# Altium project PLC_Cong.PrjPcb
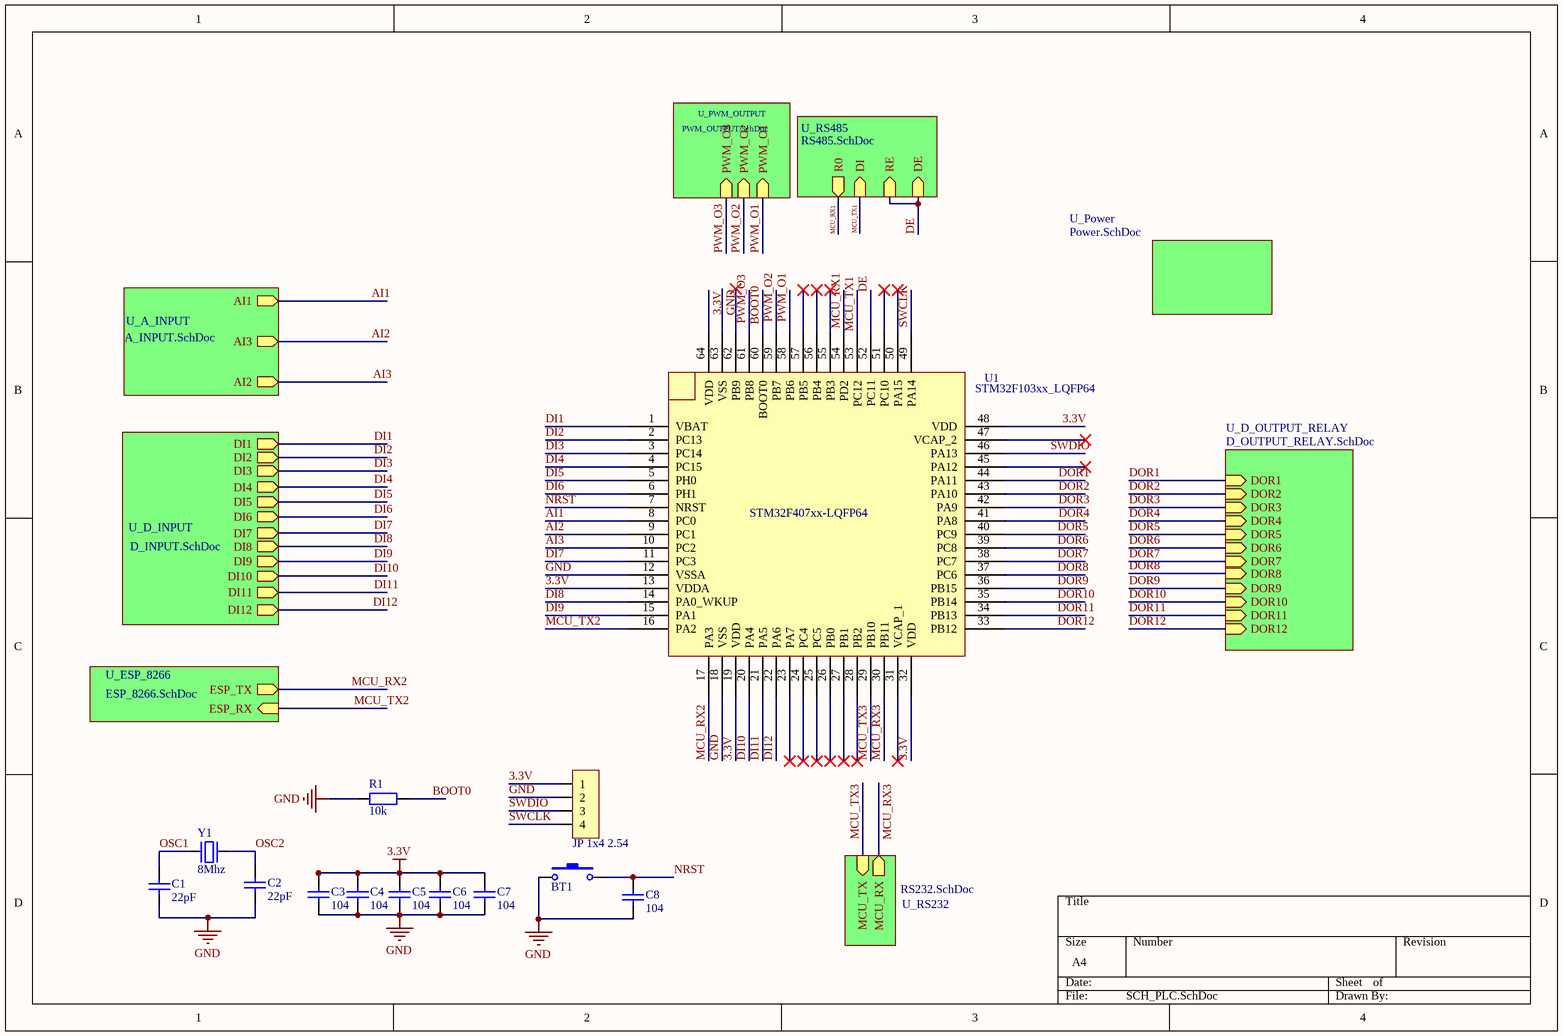
[diagram p0: SCH_PLC.SchDoc]
9 sheets, 169 parts. Net scope: hierarchical (ports join the sheet entries above them; power ports are global).
Board file: PCB_PLC.PcbDoc
Sheets:
  SCH_PLC.SchDoc
    U_A_INPUT = A_INPUT.SchDoc
    U_D_INPUT = D_INPUT.SchDoc
    U_RS232 = RS232.SchDoc
    U_RS485 = RS485.SchDoc
    U_PWM_OUTPUT = PWM_OUTPUT.SchDoc
    U_ESP_8266 = ESP_8266.SchDoc
    U_D_OUTPUT_RELAY = D_OUTPUT_RELAY.SchDoc
    U_Power = Power.SchDoc

## Sheet SCH_PLC.SchDoc
size A4; SheetNumber: 1; SheetTotal: 9

### Parts
BT1  Nut Nhan 2 Chan SMD 3x6x2.5  [Nut Nhan 2 Chan SMD 3x6x2.5]  (value not drawn)
C1  22pF  [tu 0805]
C2  22pF  [tu 0805]
C3  104  [tu 0805]
C4  104  [tu 0805]
C5  104  [tu 0805]
C6  104  [tu 0805]
C7  104  [tu 0805]
C8  104  [tu 0805]
JP1  JP 1x4 2.54  [JP 1x4 DT]
R1  10k  [tro smd 0805]
U1  STM32F103xx_LQFP64  [STM32_LQFP64]
Y1  8Mhz  [Thach Anh 2 chan SMD]

### Sub-sheets
U_A_INPUT = A_INPUT.SchDoc: AI1 (out), AI3 (out), AI2 (out)
U_D_INPUT = D_INPUT.SchDoc: DI7 (out), DI2 (out), DI12 (out), DI3 (out), DI10 (out), DI8 (out), DI11 (out), DI9 (out), DI6 (out), DI1 (out), DI5 (out), DI4 (out)
U_D_OUTPUT_RELAY = D_OUTPUT_RELAY.SchDoc: DOR6 (in), DOR8 (in), DOR12 (in), DOR11 (in), DOR5 (in), DOR4 (in), DOR3 (in), DOR1 (in), DOR7 (in), DOR2 (in), DOR9 (in), DOR10 (in)
U_ESP_8266 = ESP_8266.SchDoc: ESP_TX (out), ESP_RX (in)
U_Power = Power.SchDoc: no entries
U_PWM_OUTPUT = PWM_OUTPUT.SchDoc: PWM_O3 (in), PWM_O1 (in), PWM_O2 (in)
U_RS232 = RS232.SchDoc: MCU_RX (out), MCU_TX (in)
U_RS485 = RS485.SchDoc: RE (in), DE (in), DI (in), R0 (out)

### Nets
3.3V: C3.1 C4.1 C5.1 C6.2 C7.2 JP1.1 U1.13(VDDA) U1.19(VDD) U1.32(VDD) U1.48(VDD) U1.64(VDD)
GND: BT1.1 C1.2 C2.2 C3.2 C4.2 C5.2 C6.1 C7.1 C8.1 JP1.2 R1.1 U1.12(VSSA) U1.18(VSS) U1.63(VSS)
AI1: U1.8(PC0) ; sheet U_A_INPUT/AI1
AI2: U1.9(PC1) ; sheet U_A_INPUT/AI3
AI3: U1.10(PC2) ; sheet U_A_INPUT/AI2
BOOT0: R1.2 U1.60(BOOT0)
DE: U1.52(PC11) ; sheet U_RS485/RE, sheet U_RS485/DE
DI1: U1.1(VBAT) ; sheet U_D_INPUT/DI1
DI2: U1.2(PC13) ; sheet U_D_INPUT/DI2
DI3: U1.3(PC14) ; sheet U_D_INPUT/DI3
DI4: U1.4(PC15) ; sheet U_D_INPUT/DI4
DI5: U1.5(PH0) ; sheet U_D_INPUT/DI5
DI6: U1.6(PH1) ; sheet U_D_INPUT/DI6
DI7: U1.11(PC3) ; sheet U_D_INPUT/DI7
DI8: U1.14(PA0_WKUP) ; sheet U_D_INPUT/DI8
DI9: U1.15(PA1) ; sheet U_D_INPUT/DI9
DI10: U1.20(PA4) ; sheet U_D_INPUT/DI10
DI11: U1.21(PA5) ; sheet U_D_INPUT/DI11
DI12: U1.22(PA6) ; sheet U_D_INPUT/DI12
DOR1: U1.44(PA11) ; sheet U_D_OUTPUT_RELAY/DOR1
DOR2: U1.43(PA10) ; sheet U_D_OUTPUT_RELAY/DOR2
DOR3: U1.42(PA9) ; sheet U_D_OUTPUT_RELAY/DOR3
DOR4: U1.41(PA8) ; sheet U_D_OUTPUT_RELAY/DOR4
DOR5: U1.40(PC9) ; sheet U_D_OUTPUT_RELAY/DOR5
DOR6: U1.39(PC8) ; sheet U_D_OUTPUT_RELAY/DOR6
DOR7: U1.38(PC7) ; sheet U_D_OUTPUT_RELAY/DOR7
DOR8: U1.37(PC6) ; sheet U_D_OUTPUT_RELAY/DOR8
DOR9: U1.36(PB15) ; sheet U_D_OUTPUT_RELAY/DOR9
DOR10: U1.35(PB14) ; sheet U_D_OUTPUT_RELAY/DOR10
DOR11: U1.34(PB13) ; sheet U_D_OUTPUT_RELAY/DOR11
DOR12: U1.33(PB12) ; sheet U_D_OUTPUT_RELAY/DOR12
MCU_RX1: U1.54(PD2) ; sheet U_RS485/R0
MCU_RX2: U1.17(PA3) ; sheet U_ESP_8266/ESP_TX
MCU_RX3: U1.30(PB11) ; sheet U_RS232/MCU_RX
MCU_TX1: U1.53(PC12) ; sheet U_RS485/DI
MCU_TX2: U1.16(PA2) ; sheet U_ESP_8266/ESP_RX
MCU_TX3: U1.29(PB10) ; sheet U_RS232/MCU_TX
NRST: BT1.2 C8.2 U1.7(NRST)
OSC1: C1.1 Y1.1
OSC2: C2.1 Y1.2
PWM_O1: U1.58(PB6) ; sheet U_PWM_OUTPUT/PWM_O1
PWM_O2: U1.59(PB7) ; sheet U_PWM_OUTPUT/PWM_O2
PWM_O3: U1.61(PB8) ; sheet U_PWM_OUTPUT/PWM_O3
SWCLK: JP1.4 U1.49(PA14)
SWDIO: JP1.3 U1.46(PA13)

Not connected (* = marked no-connect by the designer): U1 23(PA7)* 24(PC4)* 25(PC5)* 26(PB0)* 27(PB1)* 28(PB2)* 31(VCAP_1)* 45(PA12)* 47(VCAP_2)* 50(PA15)* 51(PC10)* 55(PB3)* 56(PB4)* 57(PB5)* 62(PB9)*

### Notes on the sheet
- (in symbol STM32F103xx_LQFP64) STM32F407xx-LQFP64

### Library data of the parts
BT1 = Nut Nhan 2 Chan SMD 3x6x2.5: Ma_Hang: MH001036; Ten: Nút Nhấn 2 Chân 3x6x2.5MM SMD
C1 C2 = Tu 0805 22pF 50V 10%: Dán; Don_Vi: Con; So_Chan: 2; Ten_Linh_Kien: Tụ 0805 22P 10% 50V; Ma_Hang: MH004560; Chung_Loai: Dán; Kieu_Chan: *
C3-C8 = Tu 0805 104 50V 10%: Dán; Don_Vi: Con; So_Chan: 2; Ten_Linh_Kien: Tụ 0805 104-100nF 10% 50V; Ma_Hang: MH004551; Chung_Loai: Dán; Kieu_Chan: *
JP1 = JP 1x4 2.54 Duc Thang: Cắm; Ten_Linh_Kien: Jump Đơn Đực 2.54MM 1x40P Thẳng 11MM; Don_Vi: Con; Ma_Hang: MH000903; Ghi_Chu: *; Kieu_Chan: *; Chung_Loai: Cắm
R1 = Tro 0805 1% 10k: Dán; Don_Vi: Con; So_Chan: 2; Ten_Linh_Kien: Trở 0805 1% 10k; Ma_Hang: MH005473; Chung_Loai: Dán; Kieu_Chan: *
Y1 = Thach Anh 2 chan SMD: Crystal For all Crystal 2pin.; Value: 4Mhz

## Sheet A_INPUT.SchDoc
size A4; SheetNumber: 9; SheetTotal: 9
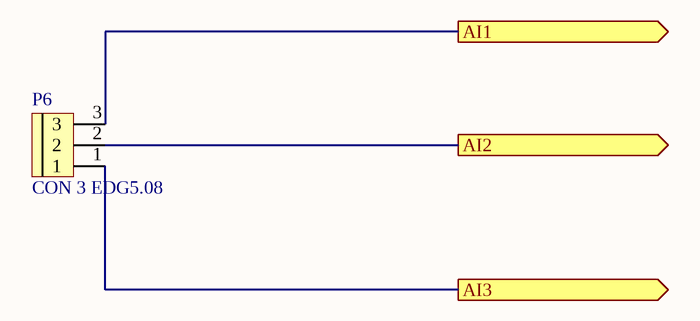
[diagram p1: A_INPUT.SchDoc]

### Parts
P6  CON 3 EDG5.08  [CON 3 3EDG5.08]

### Ports
AI1 (out), AI2 (out), AI3 (out)

### Nets
AI1: P6.3 ; port AI1
AI2: P6.1 ; port AI3
AI3: P6.2 ; port AI2

### Library data of the parts
P6 = CON 3 EDG5.08: Cắm; Ten_Linh_Kien: CON 3 2EDG5.08-3P 5.08MM ( Xanh Cong); Ma_Hang: MH000760; Ghi_Chu: *; Kieu_Chan: *; Don_Vi: Con; Chung_Loai: Cắm

## Sheet D_INPUT.SchDoc
size A4; SheetNumber: 8; SheetTotal: 9
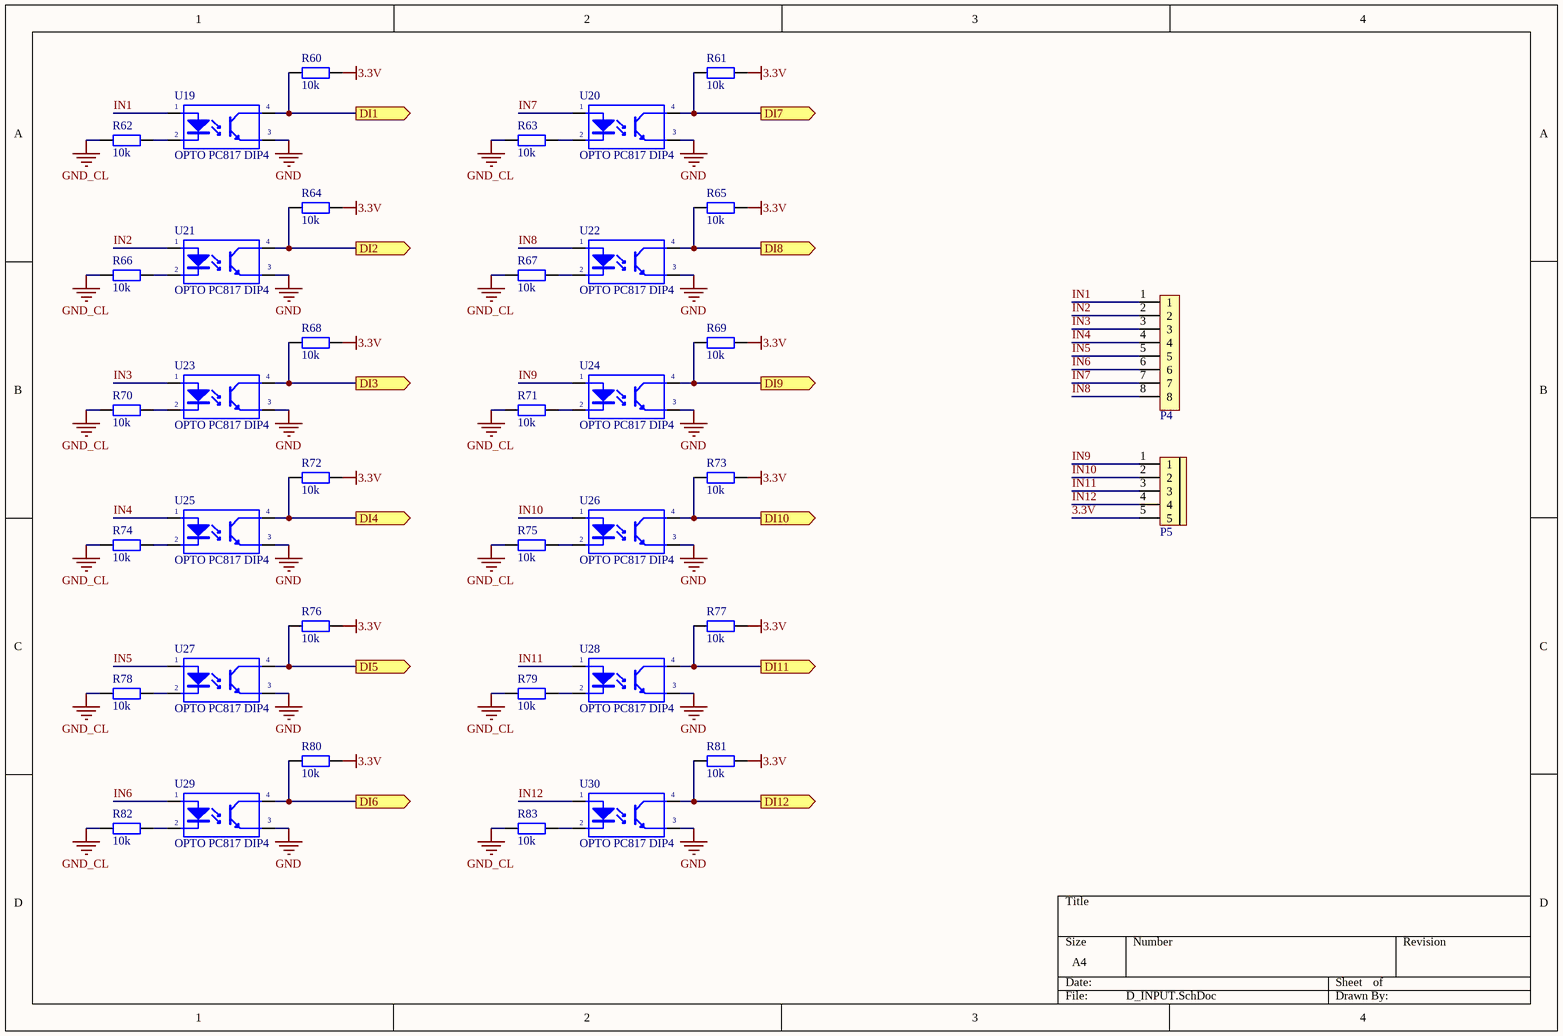
[diagram p2: D_INPUT.SchDoc]

### Parts
P4  CON 8 EDG5.08  [CON 8 8EDG5.08]  (value not drawn)
P5  CON 5 EDG5.08  [CON 5 5EDG5.08]  (value not drawn)
R60  10k  [tro smd 0805]
R61  10k  [tro smd 0805]
R62  10k  [tro smd 0805]
R63  10k  [tro smd 0805]
R64  10k  [tro smd 0805]
R65  10k  [tro smd 0805]
R66  10k  [tro smd 0805]
R67  10k  [tro smd 0805]
R68  10k  [tro smd 0805]
R69  10k  [tro smd 0805]
R70  10k  [tro smd 0805]
R71  10k  [tro smd 0805]
R72  10k  [tro smd 0805]
R73  10k  [tro smd 0805]
R74  10k  [tro smd 0805]
R75  10k  [tro smd 0805]
R76  10k  [tro smd 0805]
R77  10k  [tro smd 0805]
R78  10k  [tro smd 0805]
R79  10k  [tro smd 0805]
R80  10k  [tro smd 0805]
R81  10k  [tro smd 0805]
R82  10k  [tro smd 0805]
R83  10k  [tro smd 0805]
U19  OPTO PC817 DIP4  [DIP4]
U20  OPTO PC817 DIP4  [DIP4]
U21  OPTO PC817 DIP4  [DIP4]
U22  OPTO PC817 DIP4  [DIP4]
U23  OPTO PC817 DIP4  [DIP4]
U24  OPTO PC817 DIP4  [DIP4]
U25  OPTO PC817 DIP4  [DIP4]
U26  OPTO PC817 DIP4  [DIP4]
U27  OPTO PC817 DIP4  [DIP4]
U28  OPTO PC817 DIP4  [DIP4]
U29  OPTO PC817 DIP4  [DIP4]
U30  OPTO PC817 DIP4  [DIP4]

### Ports
DI1 (out), DI2 (out), DI3 (out), DI4 (out), DI5 (out), DI6 (out), DI7 (out), DI8 (out), DI9 (out), DI10 (out), DI11 (out), DI12 (out)

### Nets
3.3V: P5.5 R60.1 R61.1 R64.1 R65.1 R68.1 R69.1 R72.1 R73.1 R76.1 R77.1 R80.1 R81.1
GND: U19.3(E) U20.3(E) U21.3(E) U22.3(E) U23.3(E) U24.3(E) U25.3(E) U26.3(E) U27.3(E) U28.3(E) U29.3(E) U30.3(E)
GND_CL: R62.1 R63.1 R66.1 R67.1 R70.1 R71.1 R74.1 R75.1 R78.1 R79.1 R82.1 R83.1
DI1: R60.2 U19.4(C) ; port DI1
DI2: R64.2 U21.4(C) ; port DI2
DI3: R68.2 U23.4(C) ; port DI3
DI4: R72.2 U25.4(C) ; port DI4
DI5: R76.2 U27.4(C) ; port DI5
DI6: R80.2 U29.4(C) ; port DI6
DI7: R61.2 U20.4(C) ; port DI7
DI8: R65.2 U22.4(C) ; port DI8
DI9: R69.2 U24.4(C) ; port DI9
DI10: R73.2 U26.4(C) ; port DI10
DI11: R77.2 U28.4(C) ; port DI11
DI12: R81.2 U30.4(C) ; port DI12
IN1: P4.1 U19.1(A)
IN2: P4.2 U21.1(A)
IN3: P4.3 U23.1(A)
IN4: P4.4 U25.1(A)
IN5: P4.5 U27.1(A)
IN6: P4.6 U29.1(A)
IN7: P4.7 U20.1(A)
IN8: P4.8 U22.1(A)
IN9: P5.1 U24.1(A)
IN10: P5.2 U26.1(A)
IN11: P5.3 U28.1(A)
IN12: P5.4 U30.1(A)
NetR62_2: R62.2 U19.2(K)
NetR63_2: R63.2 U20.2(K)
NetR66_2: R66.2 U21.2(K)
NetR67_2: R67.2 U22.2(K)
NetR70_2: R70.2 U23.2(K)
NetR71_2: R71.2 U24.2(K)
NetR74_2: R74.2 U25.2(K)
NetR75_2: R75.2 U26.2(K)
NetR78_2: R78.2 U27.2(K)
NetR79_2: R79.2 U28.2(K)
NetR82_2: R82.2 U29.2(K)
NetR83_2: R83.2 U30.2(K)

### Library data of the parts
P4 = CON 8 EDG5.08: Cắm; Ten_Linh_Kien: CON 8 2EDG5.08-8P 5.08MM ( Xanh Cong); Ma_Hang: MH000978; Don_Vi: Con; Ghi_Chu: *; Kieu_Chan: *; Chung_Loai: Cắm
P5 = CON 5 EDG5.08: Cắm; Ten_Linh_Kien: CON 5 2EDG5.08-5P 5.08MM ( Xanh Cong); Ma_Hang: MH003589; Kieu_Chan: *; Don_Vi: Con; Ghi_Chu: *; Chung_Loai: Cắm
R60-R83 = Tro 0805 1% 10k: as R1 on sheet SCH_PLC; Chung_Loai: Dán; Kieu_Chan: *
U19-U30 = OPTO PC817 DIP4: Single Opto; Value: PC817

## Sheet RS232.SchDoc
size A4; SheetNumber: 3; SheetTotal: 9
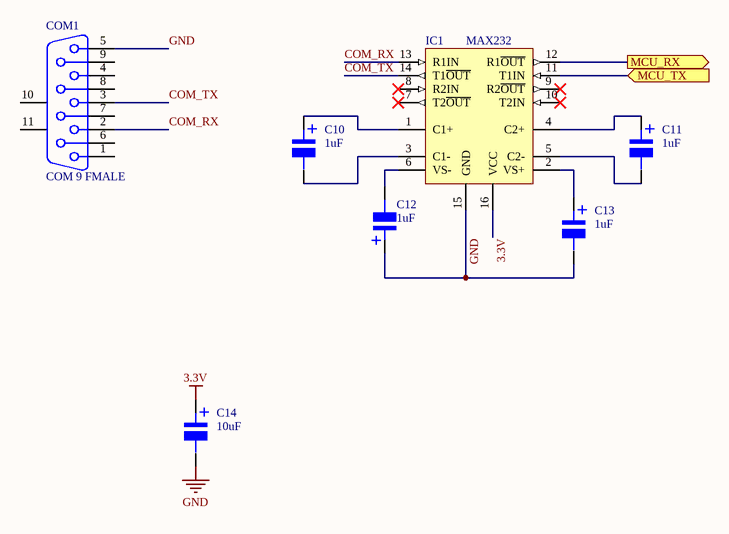
[diagram p3: RS232.SchDoc]

### Parts
C10  1uF  [tu nhom 4 (B)]
C11  1uF  [tu nhom 4 (B)]
C12  1uF  [tu nhom 4 (B)]
C13  1uF  [tu nhom 4 (B)]
C14  10uF  [tu nhom 4 (b)]
COM1  COM 9 FMALE  [DSB 9-F]
IC1  MAX232  [DIP16/W0.3]

### Ports
MCU_RX (out), MCU_TX (in)

### Nets
3.3V: C14.1 IC1.16(VCC)
GND: C12.1 C13.2 C14.2 COM1.5 IC1.15(GND)
COM_RX: COM1.2 IC1.13(R1IN)
COM_TX: COM1.3 IC1.14(T1~{OUT})
MCU_RX3: IC1.12(R1~{OUT}) ; port MCU_RX
MCU_TX3: IC1.11(T1IN) ; port MCU_TX
NetC10_1: C10.1 IC1.1(C1+)
NetC10_2: C10.2 IC1.3(C1-)
NetC11_1: C11.1 IC1.4(C2+)
NetC11_2: C11.2 IC1.5(C2-)
NetC12_2: C12.2 IC1.6(VS-)
NetC13_1: C13.1 IC1.2(VS+)

Not connected (* = marked no-connect by the designer): COM1 1 4 6 7 8 9 10(MH1) 11(MH2); IC1 7(T2~{OUT})* 8(R2IN)* 9(R2~{OUT})* 10(T2IN)*

### Notes on the sheet
- (in symbol Tu Nhom 1uF 50V) +
- (in symbol Tu Nhom 10uF 16V) +

### Library data of the parts
C10-C13 = Tu Nhom 1uF 50V: Dán; Don_Vi: Con; So_Chan: 2; Ten_Linh_Kien: Tụ Nhôm 1uF 50V 4x5.4MM; Ma_Hang: MH007467; Chung_Loai: Dán; Kieu_Chan: *
C14 = Tu Nhom 10uF 16V: Dán; Don_Vi: Con; So_Chan: 2; Ten_Linh_Kien: Tụ Nhôm 10uF 16V 4x5MM; Ma_Hang: MH001458; Chung_Loai: Dán; Kieu_Chan: *
COM1 = DSB9F: COM 9; PackageDocument: O; Positions: 9; Gender: Receptacle; Value: COM 9; Published: 15-Jun-2001; LatestRevisionDate: 17-Jul-2002; LatestRevisionNote: Re-released for DXP Platform.; DatasheetDocument: 1-Sep-1999; PackageReference: 788750; Publisher: Altium Limited; Orientation: Right Angle
IC1 = MAX232: Dual EIA-232 Driver/Receiver; Value: MAX232

## Sheet RS485.SchDoc
size A4; SheetNumber: 5; SheetTotal: 9
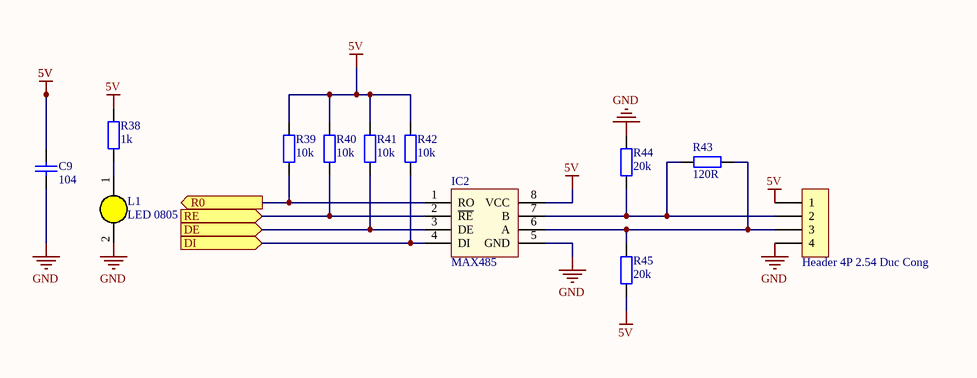
[diagram p4: RS485.SchDoc]

### Parts
C9  104  [tu 0805]
H1  Header 4P 2.54 Duc Cong  [Header 4P DC 2.54]
IC2  MAX485  [DIP8/W0.3]
L1  LED 0805  [LED-0805-Yellow]
R38  1k  [tro smd 0805]
R39  10k  [tro smd 0805]
R40  10k  [tro smd 0805]
R41  10k  [tro smd 0805]
R42  10k  [tro smd 0805]
R43  120R  [tro smd 0805]
R44  20k  [tro smd 0805]
R45  20k  [tro smd 0805]

### Ports
DE (in), DI (in), R0 (out), RE (in)

### Nets
5V: C9.2 H1.1 IC2.8(VCC) R38.2 R39.2 R40.2 R41.2 R42.2 R45.2
GND: C9.1 H1.4 IC2.5(GND) L1.2(K) R44.2
DE: IC2.2(~{RE}) IC2.3(DE) R40.1 R41.1 ; port RE, port DE
MCU_RX1: IC2.1(RO) R39.1 ; port R0
MCU_TX1: IC2.4(DI) R42.1 ; port DI
NetH1_2: H1.2 IC2.7(B) R43.1 R44.1
NetH1_3: H1.3 IC2.6(A) R43.2 R45.1
NetL1_1: L1.1(A) R38.1

### Library data of the parts
C9 = Tu 0805 104 50V 10%: as C3 on sheet SCH_PLC; Chung_Loai: Dán; Kieu_Chan: *
H1 = Header 4P 2.54 Duc Cong: Cắm; Ten_Linh_Kien: Header 4P XH2.54-4P Đực Cong; Don_Vi: Con; Ma_Hang: MH001310; Chung_Loai: Cắm
IC2 = MAX485: RS232 - RS485 (Same sn75176)
L1 = LED 0805 Vang: Dán; Don_Vi: Con; Ma_Hang: MH002329; Ten_Linh_Kien: LED 0805 Màu Vàng ( Yellow); Ghi_Chu: *; Kieu_Chan: *; Chung_Loai: Dán
R38 = Tro 0805 1% 1k: Dán; Don_Vi: Con; So_Chan: 2; Ten_Linh_Kien: Trở 0805 1% 1k; Ma_Hang: MH005468; Chung_Loai: Dán; Kieu_Chan: *
R39-R42 = Tro 0805 1% 10k: as R1 on sheet SCH_PLC; Chung_Loai: Dán; Kieu_Chan: *
R43 = Tro 0805 5% 120R: Dán; Don_Vi: Con; So_Chan: 2; Ten_Linh_Kien: Trở 0805 5% 120R; Ma_Hang: MH005253; Chung_Loai: Dán; Kieu_Chan: *
R44 R45 = Tro 0805 5% 20k: Dán; Don_Vi: Con; So_Chan: 2; Ten_Linh_Kien: Trở 0805 5% 20k; Ma_Hang: MH005247; Chung_Loai: Dán; Kieu_Chan: *

## Sheet PWM_OUTPUT.SchDoc
size A4; SheetNumber: 7; SheetTotal: 9
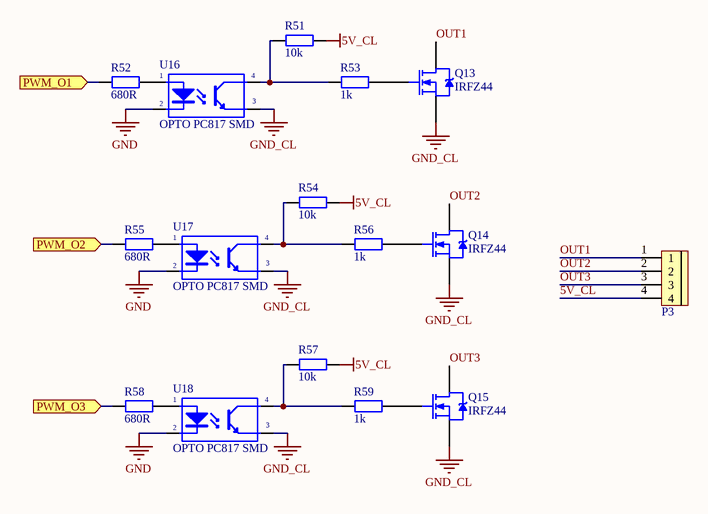
[diagram p5: PWM_OUTPUT.SchDoc]

### Parts
P3  CON 4 EDG5.08  [CON 4 4EDG5.08]  (value not drawn)
Q13  IRFZ44  [TO220]
Q14  IRFZ44  [TO220]
Q15  IRFZ44  [TO220]
R51  10k  [tro smd 0805]
R52  680R  [tro smd 0805]
R53  1k  [tro smd 0805]
R54  10k  [tro smd 0805]
R55  680R  [tro smd 0805]
R56  1k  [tro smd 0805]
R57  10k  [tro smd 0805]
R58  680R  [tro smd 0805]
R59  1k  [tro smd 0805]
U16  OPTO PC817 SMD  [SOP4]
U17  OPTO PC817 SMD  [SOP4]
U18  OPTO PC817 SMD  [SOP4]

### Ports
PWM_O1 (in), PWM_O2 (in), PWM_O3 (in)

### Nets
5V_CL: P3.4 R51.1 R54.1 R57.1
GND: U16.2(K) U17.2(K) U18.2(K)
GND_CL: Q13.3(S) Q14.3(S) Q15.3(S) U16.3(E) U17.3(E) U18.3(E)
OUT1: P3.1 Q13.2(D)
OUT2: P3.2 Q14.2(D)
OUT3: P3.3 Q15.2(D)
PWM_O1: R52.1 ; port PWM_O1
PWM_O2: R55.1 ; port PWM_O2
PWM_O3: R58.1 ; port PWM_O3
NetQ13_1: Q13.1(G) R53.2
NetQ14_1: Q14.1(G) R56.2
NetQ15_1: Q15.1(G) R59.2
NetR51_2: R51.2 R53.1 U16.4(C)
NetR52_2: R52.2 U16.1(A)
NetR54_2: R54.2 R56.1 U17.4(C)
NetR55_2: R55.2 U17.1(A)
NetR57_2: R57.2 R59.1 U18.4(C)
NetR58_2: R58.2 U18.1(A)

### Library data of the parts
P3 = CON 4 EDG5.08: Cắm; Ten_Linh_Kien: CON 4 2EDG5.08-4P 5.08MM ( Xanh Cong); Ma_Hang: MH000979; Don_Vi: Con; Ghi_Chu: *; Kieu_Chan: *; Chung_Loai: Cắm
Q13-Q15 = IRFZ44 DIP: N-Channel Power MOSFET
R51 R54 R57 = Tro 0805 1% 10k: as R1 on sheet SCH_PLC; Chung_Loai: Dán; Kieu_Chan: *
R52 R55 R58 = Tro 0805 1% 680R: Dán; Don_Vi: Con; So_Chan: 2; Ten_Linh_Kien: Trở 0805 1% 680R; Ma_Hang: MH005487; Chung_Loai: Dán; Kieu_Chan: *
R53 R56 R59 = Tro 0805 1% 1k: as R38 on sheet RS485; Chung_Loai: Dán; Kieu_Chan: *
U16-U18 = OPTO PC817 SMD: Single Opto; Value: PC817

## Sheet ESP_8266.SchDoc
size A4; SheetNumber: 6; SheetTotal: 9
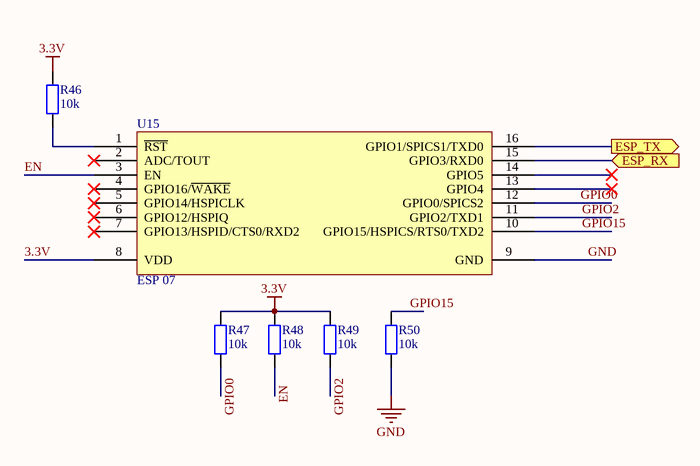
[diagram p6: ESP_8266.SchDoc]

### Parts
R46  10k  [tro smd 0805]
R47  10k  [tro smd 0805]
R48  10k  [tro smd 0805]
R49  10k  [tro smd 0805]
R50  10k  [tro smd 0805]
U15  ESP 07  [ESP8266 07]

### Ports
ESP_RX (in), ESP_TX (out)

### Nets
3.3V: R46.2 R47.2 R48.2 R49.2 U15.8(VDD)
GND: R50.1 U15.9(GND)
EN: R48.1 U15.3(EN)
GPIO0: R47.1 U15.12(GPIO0/SPICS2)
GPIO2: R49.1 U15.11(GPIO2/TXD1)
GPIO15: R50.2 U15.10(GPIO15/HSPICS/RTS0/TXD2)
MCU_RX2: U15.16(GPIO1/SPICS1/TXD0) ; port ESP_TX
MCU_TX2: U15.15(GPIO3/RXD0) ; port ESP_RX
NetR46_1: R46.1 U15.1(~{RST})

Not connected (* = marked no-connect by the designer): U15 2(ADC/TOUT)* 4(GPIO16/~{WAKE})* 5(GPIO14/HSPICLK)* 6(GPIO12/HSPIQ)* 7(GPIO13/HSPID/CTS0/RXD2)* 13(GPIO4)* 14(GPIO5)*

### Library data of the parts
R46-R50 = Tro 0805 1% 10k: as R1 on sheet SCH_PLC; Chung_Loai: Dán; Kieu_Chan: *
U15 = ESP8266 07: ESP8266 07 16 Pin; IC: ESP8266-EX; Vendor: Ai-thinker

## Sheet D_OUTPUT_RELAY.SchDoc
size A4; SheetNumber: 2; SheetTotal: 9
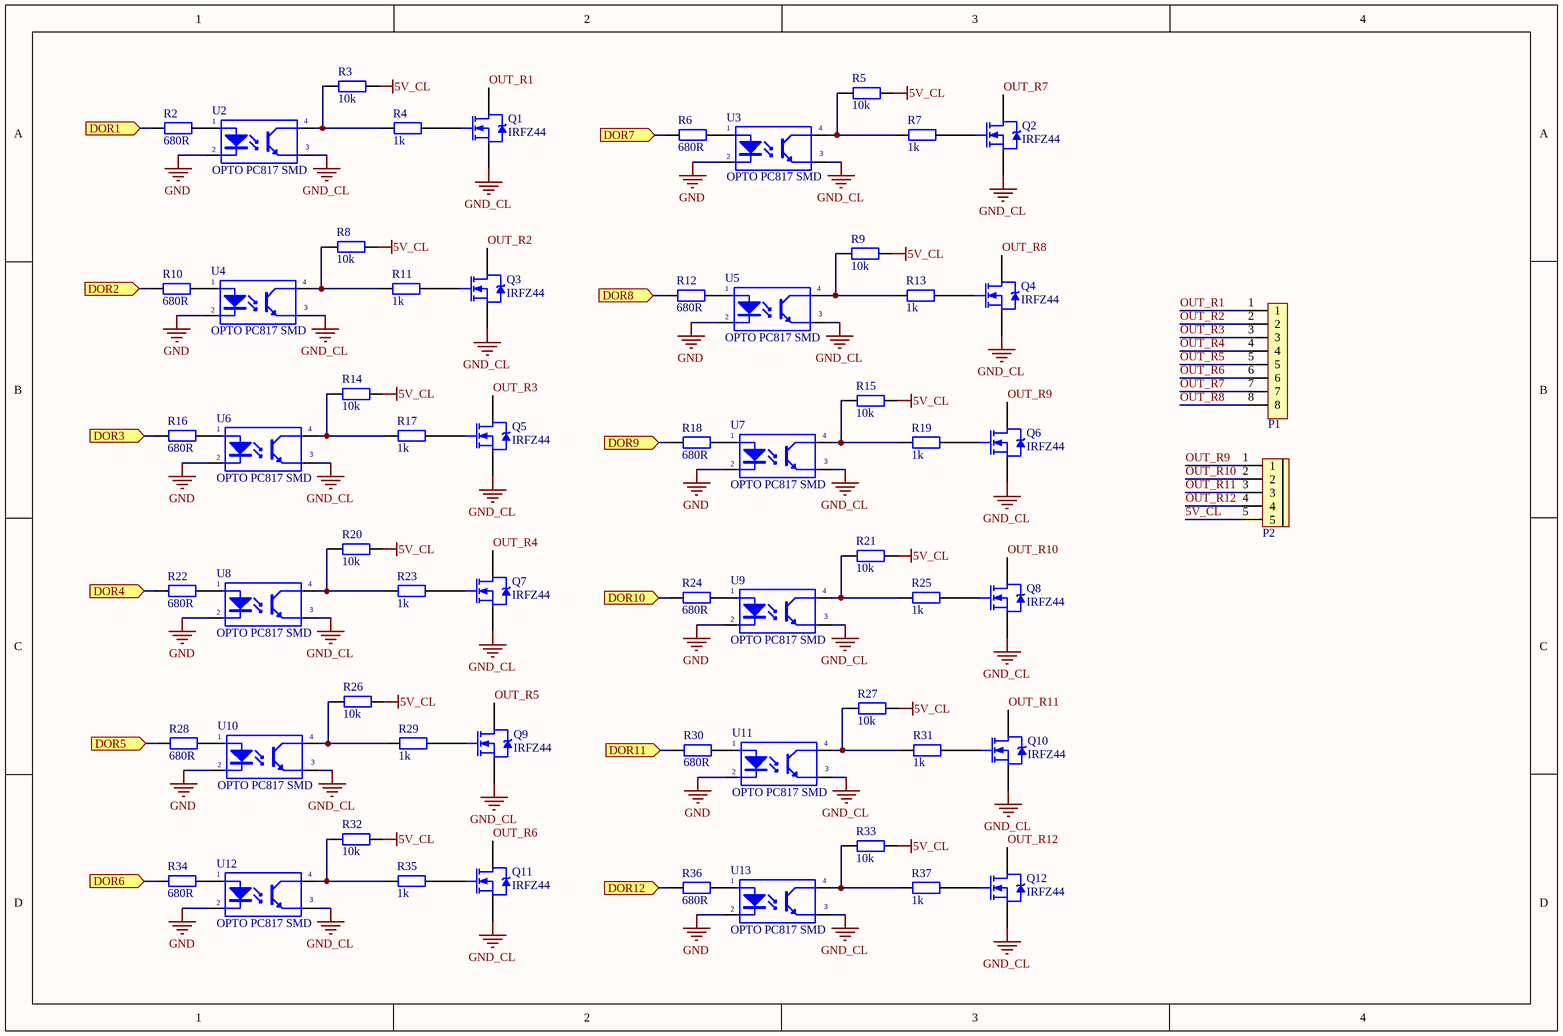
[diagram p7: D_OUTPUT_RELAY.SchDoc]

### Parts
P1  CON 8 EDG5.08  [CON 8 8EDG5.08]  (value not drawn)
P2  CON 5 EDG5.08  [CON 5 5EDG5.08]  (value not drawn)
Q1  IRFZ44  [TO220]
Q2  IRFZ44  [TO220]
Q3  IRFZ44  [TO220]
Q4  IRFZ44  [TO220]
Q5  IRFZ44  [TO220]
Q6  IRFZ44  [TO220]
Q7  IRFZ44  [TO220]
Q8  IRFZ44  [TO220]
Q9  IRFZ44  [TO220]
Q10  IRFZ44  [TO220]
Q11  IRFZ44  [TO220]
Q12  IRFZ44  [TO220]
R2  680R  [tro smd 0805]
R3  10k  [tro smd 0805]
R4  1k  [tro smd 0805]
R5  10k  [tro smd 0805]
R6  680R  [tro smd 0805]
R7  1k  [tro smd 0805]
R8  10k  [tro smd 0805]
R9  10k  [tro smd 0805]
R10  680R  [tro smd 0805]
R11  1k  [tro smd 0805]
R12  680R  [tro smd 0805]
R13  1k  [tro smd 0805]
R14  10k  [tro smd 0805]
R15  10k  [tro smd 0805]
R16  680R  [tro smd 0805]
R17  1k  [tro smd 0805]
R18  680R  [tro smd 0805]
R19  1k  [tro smd 0805]
R20  10k  [tro smd 0805]
R21  10k  [tro smd 0805]
R22  680R  [tro smd 0805]
R23  1k  [tro smd 0805]
R24  680R  [tro smd 0805]
R25  1k  [tro smd 0805]
R26  10k  [tro smd 0805]
R27  10k  [tro smd 0805]
R28  680R  [tro smd 0805]
R29  1k  [tro smd 0805]
R30  680R  [tro smd 0805]
R31  1k  [tro smd 0805]
R32  10k  [tro smd 0805]
R33  10k  [tro smd 0805]
R34  680R  [tro smd 0805]
R35  1k  [tro smd 0805]
R36  680R  [tro smd 0805]
R37  1k  [tro smd 0805]
U2  OPTO PC817 SMD  [SOP4]
U3  OPTO PC817 SMD  [SOP4]
U4  OPTO PC817 SMD  [SOP4]
U5  OPTO PC817 SMD  [SOP4]
U6  OPTO PC817 SMD  [SOP4]
U7  OPTO PC817 SMD  [SOP4]
U8  OPTO PC817 SMD  [SOP4]
U9  OPTO PC817 SMD  [SOP4]
U10  OPTO PC817 SMD  [SOP4]
U11  OPTO PC817 SMD  [SOP4]
U12  OPTO PC817 SMD  [SOP4]
U13  OPTO PC817 SMD  [SOP4]

### Ports
DOR1 (in), DOR2 (in), DOR3 (in), DOR4 (in), DOR5 (in), DOR6 (in), DOR7 (in), DOR8 (in), DOR9 (in), DOR10 (in), DOR11 (in), DOR12 (in)

### Nets
5V_CL: P2.5 R3.1 R5.1 R8.1 R9.1 R14.1 R15.1 R20.1 R21.1 R26.1 R27.1 R32.1 R33.1
GND: U2.2(K) U3.2(K) U4.2(K) U5.2(K) U6.2(K) U7.2(K) U8.2(K) U9.2(K) U10.2(K) U11.2(K) U12.2(K) U13.2(K)
GND_CL: Q1.3(S) Q2.3(S) Q3.3(S) Q4.3(S) Q5.3(S) Q6.3(S) Q7.3(S) Q8.3(S) Q9.3(S) Q10.3(S) Q11.3(S) Q12.3(S) U2.3(E) U3.3(E) U4.3(E) U5.3(E) U6.3(E) U7.3(E) U8.3(E) U9.3(E) U10.3(E) U11.3(E) U12.3(E) U13.3(E)
DOR1: R2.1 ; port DOR1
DOR2: R10.1 ; port DOR2
DOR3: R16.1 ; port DOR3
DOR4: R22.1 ; port DOR4
DOR5: R28.1 ; port DOR5
DOR6: R34.1 ; port DOR6
DOR7: R6.1 ; port DOR7
DOR8: R12.1 ; port DOR8
DOR9: R18.1 ; port DOR9
DOR10: R24.1 ; port DOR10
DOR11: R30.1 ; port DOR11
DOR12: R36.1 ; port DOR12
OUT_R1: P1.1 Q1.2(D)
OUT_R2: P1.2 Q3.2(D)
OUT_R3: P1.3 Q5.2(D)
OUT_R4: P1.4 Q7.2(D)
OUT_R5: P1.5 Q9.2(D)
OUT_R6: P1.6 Q11.2(D)
OUT_R7: P1.7 Q2.2(D)
OUT_R8: P1.8 Q4.2(D)
OUT_R9: P2.1 Q6.2(D)
OUT_R10: P2.2 Q8.2(D)
OUT_R11: P2.3 Q10.2(D)
OUT_R12: P2.4 Q12.2(D)
NetQ1_1: Q1.1(G) R4.2
NetQ2_1: Q2.1(G) R7.2
NetQ3_1: Q3.1(G) R11.2
NetQ4_1: Q4.1(G) R13.2
NetQ5_1: Q5.1(G) R17.2
NetQ6_1: Q6.1(G) R19.2
NetQ7_1: Q7.1(G) R23.2
NetQ8_1: Q8.1(G) R25.2
NetQ9_1: Q9.1(G) R29.2
NetQ10_1: Q10.1(G) R31.2
NetQ11_1: Q11.1(G) R35.2
NetQ12_1: Q12.1(G) R37.2
NetR2_2: R2.2 U2.1(A)
NetR3_2: R3.2 R4.1 U2.4(C)
NetR5_2: R5.2 R7.1 U3.4(C)
NetR6_2: R6.2 U3.1(A)
NetR8_2: R8.2 R11.1 U4.4(C)
NetR9_2: R9.2 R13.1 U5.4(C)
NetR10_2: R10.2 U4.1(A)
NetR12_2: R12.2 U5.1(A)
NetR14_2: R14.2 R17.1 U6.4(C)
NetR15_2: R15.2 R19.1 U7.4(C)
NetR16_2: R16.2 U6.1(A)
NetR18_2: R18.2 U7.1(A)
NetR20_2: R20.2 R23.1 U8.4(C)
NetR21_2: R21.2 R25.1 U9.4(C)
NetR22_2: R22.2 U8.1(A)
NetR24_2: R24.2 U9.1(A)
NetR26_2: R26.2 R29.1 U10.4(C)
NetR27_2: R27.2 R31.1 U11.4(C)
NetR28_2: R28.2 U10.1(A)
NetR30_2: R30.2 U11.1(A)
NetR32_2: R32.2 R35.1 U12.4(C)
NetR33_2: R33.2 R37.1 U13.4(C)
NetR34_2: R34.2 U12.1(A)
NetR36_2: R36.2 U13.1(A)

### Library data of the parts
P1 = CON 8 EDG5.08: as P4 on sheet D_INPUT; Don_Vi: Con; Ghi_Chu: *; Kieu_Chan: *; Chung_Loai: Cắm
P2 = CON 5 EDG5.08: as P5 on sheet D_INPUT; Kieu_Chan: *; Don_Vi: Con; Ghi_Chu: *; Chung_Loai: Cắm
Q1-Q12 = IRFZ44 DIP: N-Channel Power MOSFET
R2 R6 R10 R12 R16 R18 R22 R24 R28 R30 R34 R36 = Tro 0805 1% 680R: as R52 on sheet PWM_OUTPUT; Chung_Loai: Dán; Kieu_Chan: *
R3 R5 R8 R9 R14 R15 R20 R21 R26 R27 R32 R33 = Tro 0805 1% 10k: as R1 on sheet SCH_PLC; Chung_Loai: Dán; Kieu_Chan: *
R4 R7 R11 R13 R17 R19 R23 R25 R29 R31 R35 R37 = Tro 0805 1% 1k: as R38 on sheet RS485; Chung_Loai: Dán; Kieu_Chan: *
U2-U13 = OPTO PC817 SMD: Single Opto; Value: PC817

## Sheet Power.SchDoc
size A4; SheetNumber: 4; SheetTotal: 9
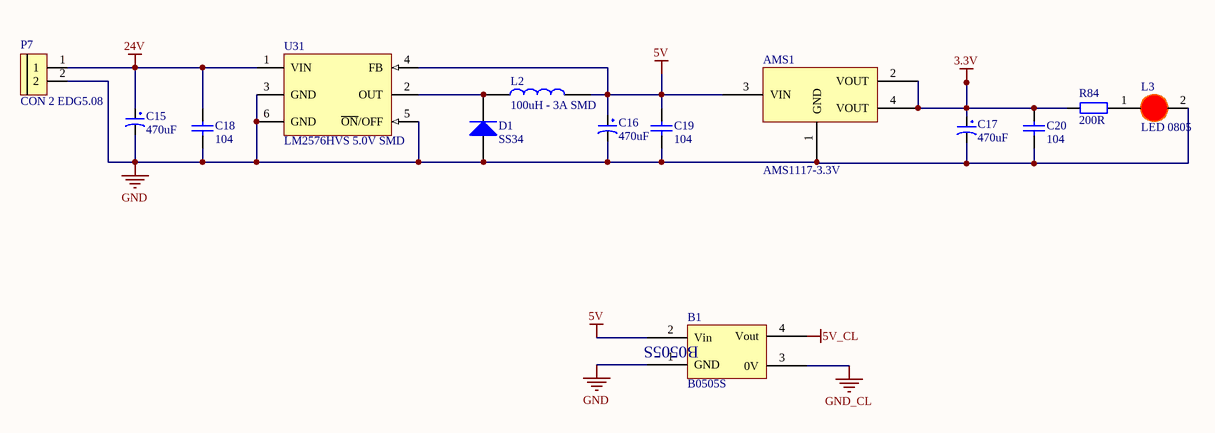
[diagram p8: Power.SchDoc]

### Parts
AMS1  AMS1117-3.3V  [SOT223]
B1  B0505S  [B0505S]
C15  470uF  [tu hoa 10mm]
C16  470uF  [tu hoa 8mm]
C17  470uF  [tu hoa 8mm]
C18  104  [tu 0805]
C19  104  [tu 0805]
C20  104  [tu 0805]
D1  SS34  [DIODE SMA]
L2  100uH - 3A SMD  [Cuon Cam 12x12x10]
L3  LED 0805  [LED-0805-Red]
P7  CON 2 EDG5.08  [CON 2 2EDG5.08]
R84  200R  [tro smd 0805]
U31  LM2576HVS 5.0V SMD  [TO263-5]

### Nets
3.3V: AMS1.2(VOUT) AMS1.4(VOUT) C17.1 C20.1 R84.1
5V: AMS1.3(VIN) B1.2(Vin) C16.1 C19.1 L2.2 U31.4(FB)
5V_CL: B1.4(Vout)
24V: C15.1 C18.1 P7.1 U31.1(VIN)
GND: AMS1.1(GND) B1.1(GND) C15.2 C16.2 C17.2 C18.2 C19.2 C20.2 D1.1(A) L3.2(K) P7.2 U31.3(GND) U31.5(~{ON}/OFF) U31.6(GND)
GND_CL: B1.3(0V)
NetD1_2: D1.2(K) L2.1 U31.2(OUT)
NetL3_1: L3.1(A) R84.2

### Library data of the parts
AMS1 = AMS1117 SMD: Dán; Value: AMS1117-3.3V SOT223; Don_Vi: Con; Ma_Hang: MH000596; Ghi_Chu: *; Kieu_Chan: *; Chung_Loai: Dán
B1 = B0505S: Cắm; Ten_Linh_Kien: B0505S-1W SIP4 IC Converter DC-DC; Don_Vi: Con; Ma_Hang: MH003143; Ghi_Chu: *; Kieu_Chan: *; Chung_Loai: Cắm
C15 = Tu Hoa 470uF 50V 10x17: Cắm; Don_Vi: Con; So_Chan: 2; Ten_Linh_Kien: Tụ Hóa 470uF 50V; Ma_Hang: MH006866; Chung_Loai: Cắm; Kieu_Chan: *
C16 C17 = Tu Hoa 470uF 16V 8x11: Cắm; Don_Vi: Con; So_Chan: 2; Ten_Linh_Kien: Tụ Hóa 470uF 16V 8x11MM; Ma_Hang: MH006550; Chung_Loai: Cắm; Kieu_Chan: *
C18-C20 = Tu 0805 104 50V 10%: as C3 on sheet SCH_PLC; Chung_Loai: Dán; Kieu_Chan: *
D1 = Diode SS34 ( 1N5822 ): Dán; Don_Vi: Con; Ma_Hang: MH002104; Ten_Linh_Kien: Diode SS34 3A 40V SMA ( 1N5822 SS34A); Kieu_Chan: *; Chung_Loai: Dán
L2 = CUON CAM 100uH SMD: Dán; Don_Vi: Con; Ma_Hang: MH003999; Ten_Linh_Kien: Cuộn Cảm 100uH 7x7x4MM CD74; Ma_Hang: *; Kieu_Chan: *; Chung_Loai: Dán
L3 = LED 0805 Do: Dán; Don_Vi: Con; Ma_Hang: MH000897; Ten_Linh_Kien: LED 0805 Màu Đỏ (Red); Ghi_Chu: *; Kieu_Chan: *; Chung_Loai: Dán
P7 = CON 2 EDG5.08: Cắm; Ten_Linh_Kien: CON 2 2EDG5.08-2P 5.08MM ( Xanh Cong); Ma_Hang: MH000759; Ghi_Chu: *; Don_Vi: Con; Kieu_Chan: *; Chung_Loai: Cắm
R84 = Tro 0805 5% 200R: Dán; Don_Vi: Con; So_Chan: 2; Ten_Linh_Kien: Trở 0805 5% 200R; Ma_Hang: MH005257; Chung_Loai: Dán; Kieu_Chan: *
U31 = LM2576HVS 5.0V SMD: Dán; Ten_Linh_Kien: LM2576HVS-5.0V BUCK 5V 3A TO263-5; Don_Vi: Con; Ma_Hang: MH002362; Ghi_Chu: *; Kieu_Chan: *; Chung_Loai: Dán

## Nets that join several sheets
3.3V: SCH_PLC (11 pins), D_INPUT (13 pins), RS232 (C14.1 IC1.16), ESP_8266 (5 pins), Power (5 pins)
5V: RS485 (9 pins), Power (6 pins)
5V_CL: PWM_OUTPUT (P3.4 R51.1 R54.1 R57.1), D_OUTPUT_RELAY (13 pins), Power (B1.4)
GND: SCH_PLC (14 pins), D_INPUT (12 pins), RS232 (5 pins), RS485 (5 pins), PWM_OUTPUT (U16.2 U17.2 U18.2), ESP_8266 (R50.1 U15.9), D_OUTPUT_RELAY (12 pins), Power (14 pins)
GND_CL: D_INPUT (12 pins), PWM_OUTPUT (6 pins), D_OUTPUT_RELAY (24 pins), Power (B1.3)
AI1: SCH_PLC (U1.8), A_INPUT (P6.3)
AI2: SCH_PLC (U1.9), A_INPUT (P6.1)
AI3: SCH_PLC (U1.10), A_INPUT (P6.2)
DE: SCH_PLC (U1.52), RS485 (IC2.2 IC2.3 R40.1 R41.1)
DI1: SCH_PLC (U1.1), D_INPUT (R60.2 U19.4)
DI2: SCH_PLC (U1.2), D_INPUT (R64.2 U21.4)
DI3: SCH_PLC (U1.3), D_INPUT (R68.2 U23.4)
DI4: SCH_PLC (U1.4), D_INPUT (R72.2 U25.4)
DI5: SCH_PLC (U1.5), D_INPUT (R76.2 U27.4)
DI6: SCH_PLC (U1.6), D_INPUT (R80.2 U29.4)
DI7: SCH_PLC (U1.11), D_INPUT (R61.2 U20.4)
DI8: SCH_PLC (U1.14), D_INPUT (R65.2 U22.4)
DI9: SCH_PLC (U1.15), D_INPUT (R69.2 U24.4)
DI10: SCH_PLC (U1.20), D_INPUT (R73.2 U26.4)
DI11: SCH_PLC (U1.21), D_INPUT (R77.2 U28.4)
DI12: SCH_PLC (U1.22), D_INPUT (R81.2 U30.4)
DOR1: SCH_PLC (U1.44), D_OUTPUT_RELAY (R2.1)
DOR2: SCH_PLC (U1.43), D_OUTPUT_RELAY (R10.1)
DOR3: SCH_PLC (U1.42), D_OUTPUT_RELAY (R16.1)
DOR4: SCH_PLC (U1.41), D_OUTPUT_RELAY (R22.1)
DOR5: SCH_PLC (U1.40), D_OUTPUT_RELAY (R28.1)
DOR6: SCH_PLC (U1.39), D_OUTPUT_RELAY (R34.1)
DOR7: SCH_PLC (U1.38), D_OUTPUT_RELAY (R6.1)
DOR8: SCH_PLC (U1.37), D_OUTPUT_RELAY (R12.1)
DOR9: SCH_PLC (U1.36), D_OUTPUT_RELAY (R18.1)
DOR10: SCH_PLC (U1.35), D_OUTPUT_RELAY (R24.1)
DOR11: SCH_PLC (U1.34), D_OUTPUT_RELAY (R30.1)
DOR12: SCH_PLC (U1.33), D_OUTPUT_RELAY (R36.1)
MCU_RX1: SCH_PLC (U1.54), RS485 (IC2.1 R39.1)
MCU_RX2: SCH_PLC (U1.17), ESP_8266 (U15.16)
MCU_RX3: SCH_PLC (U1.30), RS232 (IC1.12)
MCU_TX1: SCH_PLC (U1.53), RS485 (IC2.4 R42.1)
MCU_TX2: SCH_PLC (U1.16), ESP_8266 (U15.15)
MCU_TX3: SCH_PLC (U1.29), RS232 (IC1.11)
PWM_O1: SCH_PLC (U1.58), PWM_OUTPUT (R52.1)
PWM_O2: SCH_PLC (U1.59), PWM_OUTPUT (R55.1)
PWM_O3: SCH_PLC (U1.61), PWM_OUTPUT (R58.1)